# Altium schematic sheet schematic.SchDoc
size A; SheetNumber: 1; SheetTotal: 1
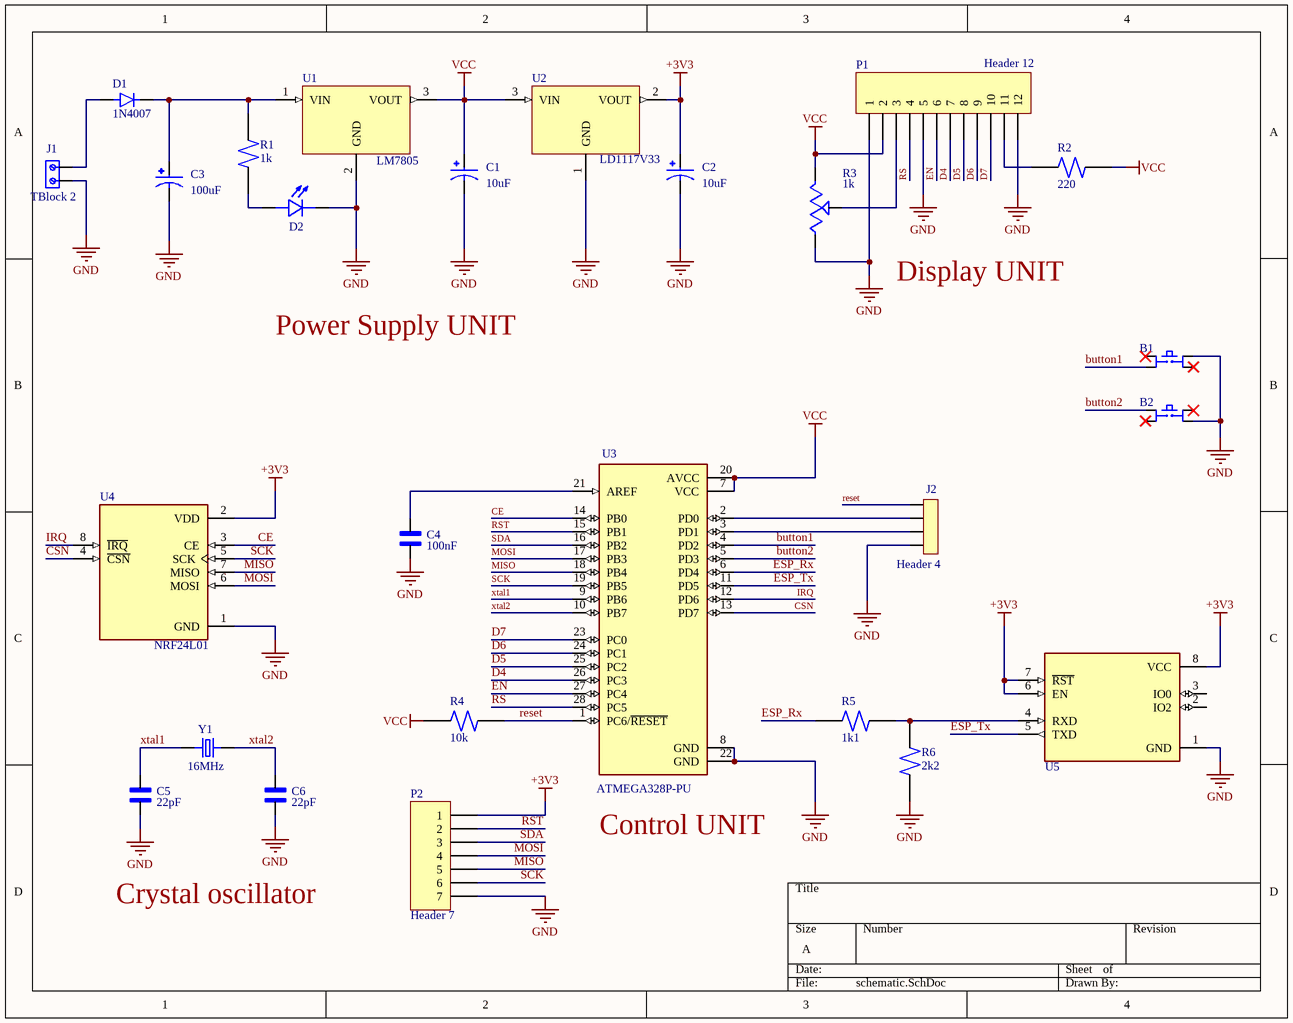
[diagram p0: schematic.SchDoc]

## Parts
B1  Push button  [SW_TS02-66-95-BK-260-LCR-D]  (value not drawn)
B2  Push button  [SW_TS02-66-95-BK-260-LCR-D]  (value not drawn)
C1  10uF  [CAPPRD500W50D500H1100]
C2  10uF  [CAPPRD500W50D500H1100]
C3  100uF  [CAPPRD500W50D500H1100]
C4  100nF  [CAPRB500W50L450T300H550]
C5  22pF  [CAPRB500W50L450T300H550]
C6  22pF  [CAPRB500W50L450T300H550]
D1  1N4007  [DIOAD1060W80L520D270]
D2  L08R5000Q1  [LEDRD254W57D500H1070]  (value not drawn)
J1  TBlock 2  [691111710002]
J2  Header 4  [SULLINS_PPTC041LFBN-RC]
P1  Header 12  [HDR1X12]
P2  Header 7  [HDR1X7]
R1  1k  [RESAD1100W55L680D260]
R2  220  [RESAD1100W55L680D260]
R3  1k  [TRIM_3306F-1-105]
R4  10k  [RESAD1100W55L680D260]
R5  1k1  [RESAD1100W55L680D260]
R6  2k2  [RESAD1100W55L680D260]
U1  LM7805  [TO255P1020X450X1968-3]
U2  LD1117V33  [TO255P1020X450X1968-3]
U3  ATMEGA328P-PU  [DIP794W46P254L2967H457Q28B]
U4  NRF24L01  [XCVR_NRF24L01P-MODULE-PCB]
U5  ESP8266-01/ESP-01  [XCVR_ESP8266-01/ESP-01]  (value not drawn)
Y1  16MHz  [XTAL_ECS-160-20-4X]

## Nets
+3V3: C2.P P2.1 U2.2(VOUT) U4.2(VDD) U5.6(EN) U5.7(~{RST}) U5.8(VCC)
GND: B1.3 B2.4 C1.N C2.N C3.N C4.2 C5.2 C6.2 D2.C J1.1 J2.1 P1.1 P1.5 P1.12 P2.7 R3.1(CCW) R6.1 U1.2(GND) U2.1(GND) U3.8(GND) U3.22(GND) U4.1(GND) U5.1(GND)
VCC: C1.P P1.2 R2.1 R3.3(CW) R4.2 U1.3(VOUT) U2.3(VIN) U3.7(VCC) U3.20(AVCC)
button1: B1.2 U3.4(PD2)
button2: B2.1 U3.5(PD3)
CE: U3.14(PB0) U4.3(CE)
CSN: U3.13(PD7) U4.4(~{CSN})
D4: P1.7 U3.26(PC3)
D5: P1.8 U3.25(PC2)
D6: P1.9 U3.24(PC1)
D7: P1.10 U3.23(PC0)
EN: P1.6 U3.27(PC4)
ESP_Rx: R5.2 U3.6(PD4)
ESP_Tx: U3.11(PD5) U5.5(TXD)
IRQ: U3.12(PD6) U4.8(~{IRQ})
MISO: P2.5 U3.18(PB4) U4.7(MISO)
MOSI: P2.4 U3.17(PB3) U4.6(MOSI)
reset: J2.4 R4.1 U3.1(PC6/~{RESET})
RS: P1.4 U3.28(PC5)
RST: P2.2 U3.15(PB1)
SCK: P2.6 U3.19(PB5) U4.5(SCK)
SDA: P2.3 U3.16(PB2)
xtal1: C5.1 U3.9(PB6) Y1.1
xtal2: C6.1 U3.10(PB7) Y1.2
NetC3_P: C3.P D1.C R1.2 U1.1(VIN)
NetC4_1: C4.1 U3.21(AREF)
NetD1_A: D1.A J1.2
NetD2_A: D2.A R1.1
NetJ2_2: J2.2 U3.3(PD1)
NetJ2_3: J2.3 U3.2(PD0)
NetP1_3: P1.3 R3.2(WIPER)
NetP1_11: P1.11 R2.2
NetR5_1: R5.1 R6.2 U5.4(RXD)

Not connected (* = marked no-connect by the designer): B1 1* 4*; B2 2* 3*; U5 2(IO2) 3(IO0)

## Notes on the sheet
- Display UNIT
- Power Supply UNIT
- (near U3) Control UNIT
- Crystal oscillator

## Library data of the parts
C1-C3 = Electrolytic capacitor: FS-A; MF: {'manufacturer': u'Panasonic'}; MP: EEUFS0J221B; Package: None; Value: *; Availability: Unavailable; Price: None
C4-C6 = Ceramic capacitor: 2200 pF Â±10% 250V Ceramic Capacitor X7R Radial; MF: TDK; MP: FG24X7R2E222KNT06; Digi-Key_Part_Number: 445-173386-1-ND; Purchase-URL: https://pricing.snapeda.com/search/part/FG24X7R2E222KNT06/?ref=eda; Check_prices: https://www.snapeda.com/parts/FG24X7R2E222KNT06/TDK/view-part/?ref=eda; Value: *; Package: Radial TDK; SnapEDA_Link: https://www.snapeda.com/parts/FG24X7R2E222KNT06/TDK/view-part/?ref=snap
D1 = 1N4007: Diode Switching 1KV 1A 2-Pin DO-41; Price: None; MP: 1N4007; Value: *; Availability: Unavailable; Package: None
D2 = LED: LED, Orange, Through Hole, T-1 3/4 (5mm), 30 mA, 2.1 V, 635 nm; MF: {'manufacturer': u'LED Technology'}; Price: None; Package: None; Availability: Unavailable; MP: L08R5000Q1; Value: *
J1 = Terminal Block - 2Pins: 2 Position Wire to Board Terminal Block Horizontal with Board 0.197 _5.00mm_ Through Hole; MF: Wurth Electronics; Value: *; Availability: Unavailable; MP: 691111710002; Price: None; Package: None; SnapEDA_Link: https://www.snapeda.com/parts/691111710002/Wurth%20Electronics%20Inc./view-part/1195092/?ref=snap
J2 = Female header - 4Pins: 4 Position Header Connector Through Hole; MP: PPTC041LFBN-RC; MF: Sullins Connector; Value: *; SnapEDA_Link: https://www.snapeda.com/parts/PPTC041LFBN-RC/Sullins%20Connector%20Solutions/view-part/285917/?ref=snap; Package: None; Availability: Warning; Check_prices: https://www.snapeda.com/parts/PPTC041LFBN-RC/Sullins%20Connector%20Solutions/view-part/285917/?ref=eda; Price: None; Purchase-URL: https://pricing.snapeda.com/search/part/PPTC041LFBN-RC/?ref=eda
P1 = Header 12: Header, 12-Pin; LatestRevisionDate: 17-Jul-2002; LatestRevisionNote: Re-released for DXP Platform.; Publisher: Altium Limited
P2 = Header 7: Header, 7-Pin; LatestRevisionDate: 17-Jul-2002; LatestRevisionNote: Re-released for DXP Platform.; Publisher: Altium Limited
R1 R2 R4-R6 = Resistor (0.25W): (MFR-25FBF52-10K) 10,2 kOhm bei 1% 0,25W, 1/4W Durchbohrlochwiderstand Axial Metal Film; MF: Yageo; Digi-Key_Part_Number: 10.2KXBK-ND; SnapEDA_Link: https://www.snapeda.com/parts/MFR-25FBF52-10K/Yageo/view-part/424333/?ref=snap; Package: Axial Yageo; Purchase-URL: https://pricing.snapeda.com/search/part/MFR-25FBF52-10K/?ref=eda; MP: MFR-25FBF52-10K; Value: *
R3 = Potentiometer1: (3306F-1-105) 1 MOhms 0.2W, 1/5W PC Pins Through Hole Trimmer Potentiometer Cermet 1 Turn Top Adjustment; MF: Bourns; Check_prices: https://www.snapeda.com/parts/3306F-1-105/Bourns%20-%20J.W.%20Miller/view-part/862876/?ref=eda; Availability: Good; Value: *; Price: None; MP: 3306F-1-105; SnapEDA_Link: https://www.snapeda.com/parts/3306F-1-105/Bourns%20-%20J.W.%20Miller/view-part/862876/?ref=snap; Package: 3306F Bourns; Purchase-URL: https://pricing.snapeda.com/search/part/3306F-1-105/?ref=eda
U1 = LM78__: MP: LM7805CT/NOPB; Price: None; Value: *; Availability: Unavailable; Package: None
U3 = ATMEGA328P-PU: ATmega Series 20 MHz 32 KB Flash 2 KB SRAM 8-Bit Microcontroller - DIP-28; Value: *; MP: ATMEGA328P-PU; Package: None; Availability: Unavailable; Price: None
U4 = NRF24L01P-MODULE-PCB: - Transceiver For Use With nRF24L01+; MF: Nordic Semiconductor; Package: None; MP: NRF24L01P-MODULE-PCB; Value: *; Availability: Bad; Price: None; SnapEDA_Link: https://www.snapeda.com/parts/NRF24L01P-MODULE-PCB/Nordic%20Semiconductor%20ASA/view-part/230534/?ref=snap; Mouser-Purchase-URL: https://snapeda.com/shop?store=Mouser&id=230534
U5 = ESP8266-01 Module: MakerFocus 4pcs ESP8266 ESP-01 Serial Wireless WiFi Transceiver Receiver Module 1MB SPI Flash DC3.0-3.6V Internet of Things WiFi Module Board Compatible with Ar duino; Value: *; MP: ESP8266-01/ESP-01; Package: None; Availability: Unavailable; Price: None
Y1 = Crystal oscilator: CRYSTAL T/H; MF: {'manufacturer': u'ECS Inc.'}; MP: ECS-160-S-4; Package: None; Value: *; Availability: Unavailable; Price: None
U2 = LD1117V33: Package: None; MP: LD1117V33; Price: None; Availability: Unavailable; Value: *